# EAGLE schematic RAUPS (EAGLE 7.2.0)
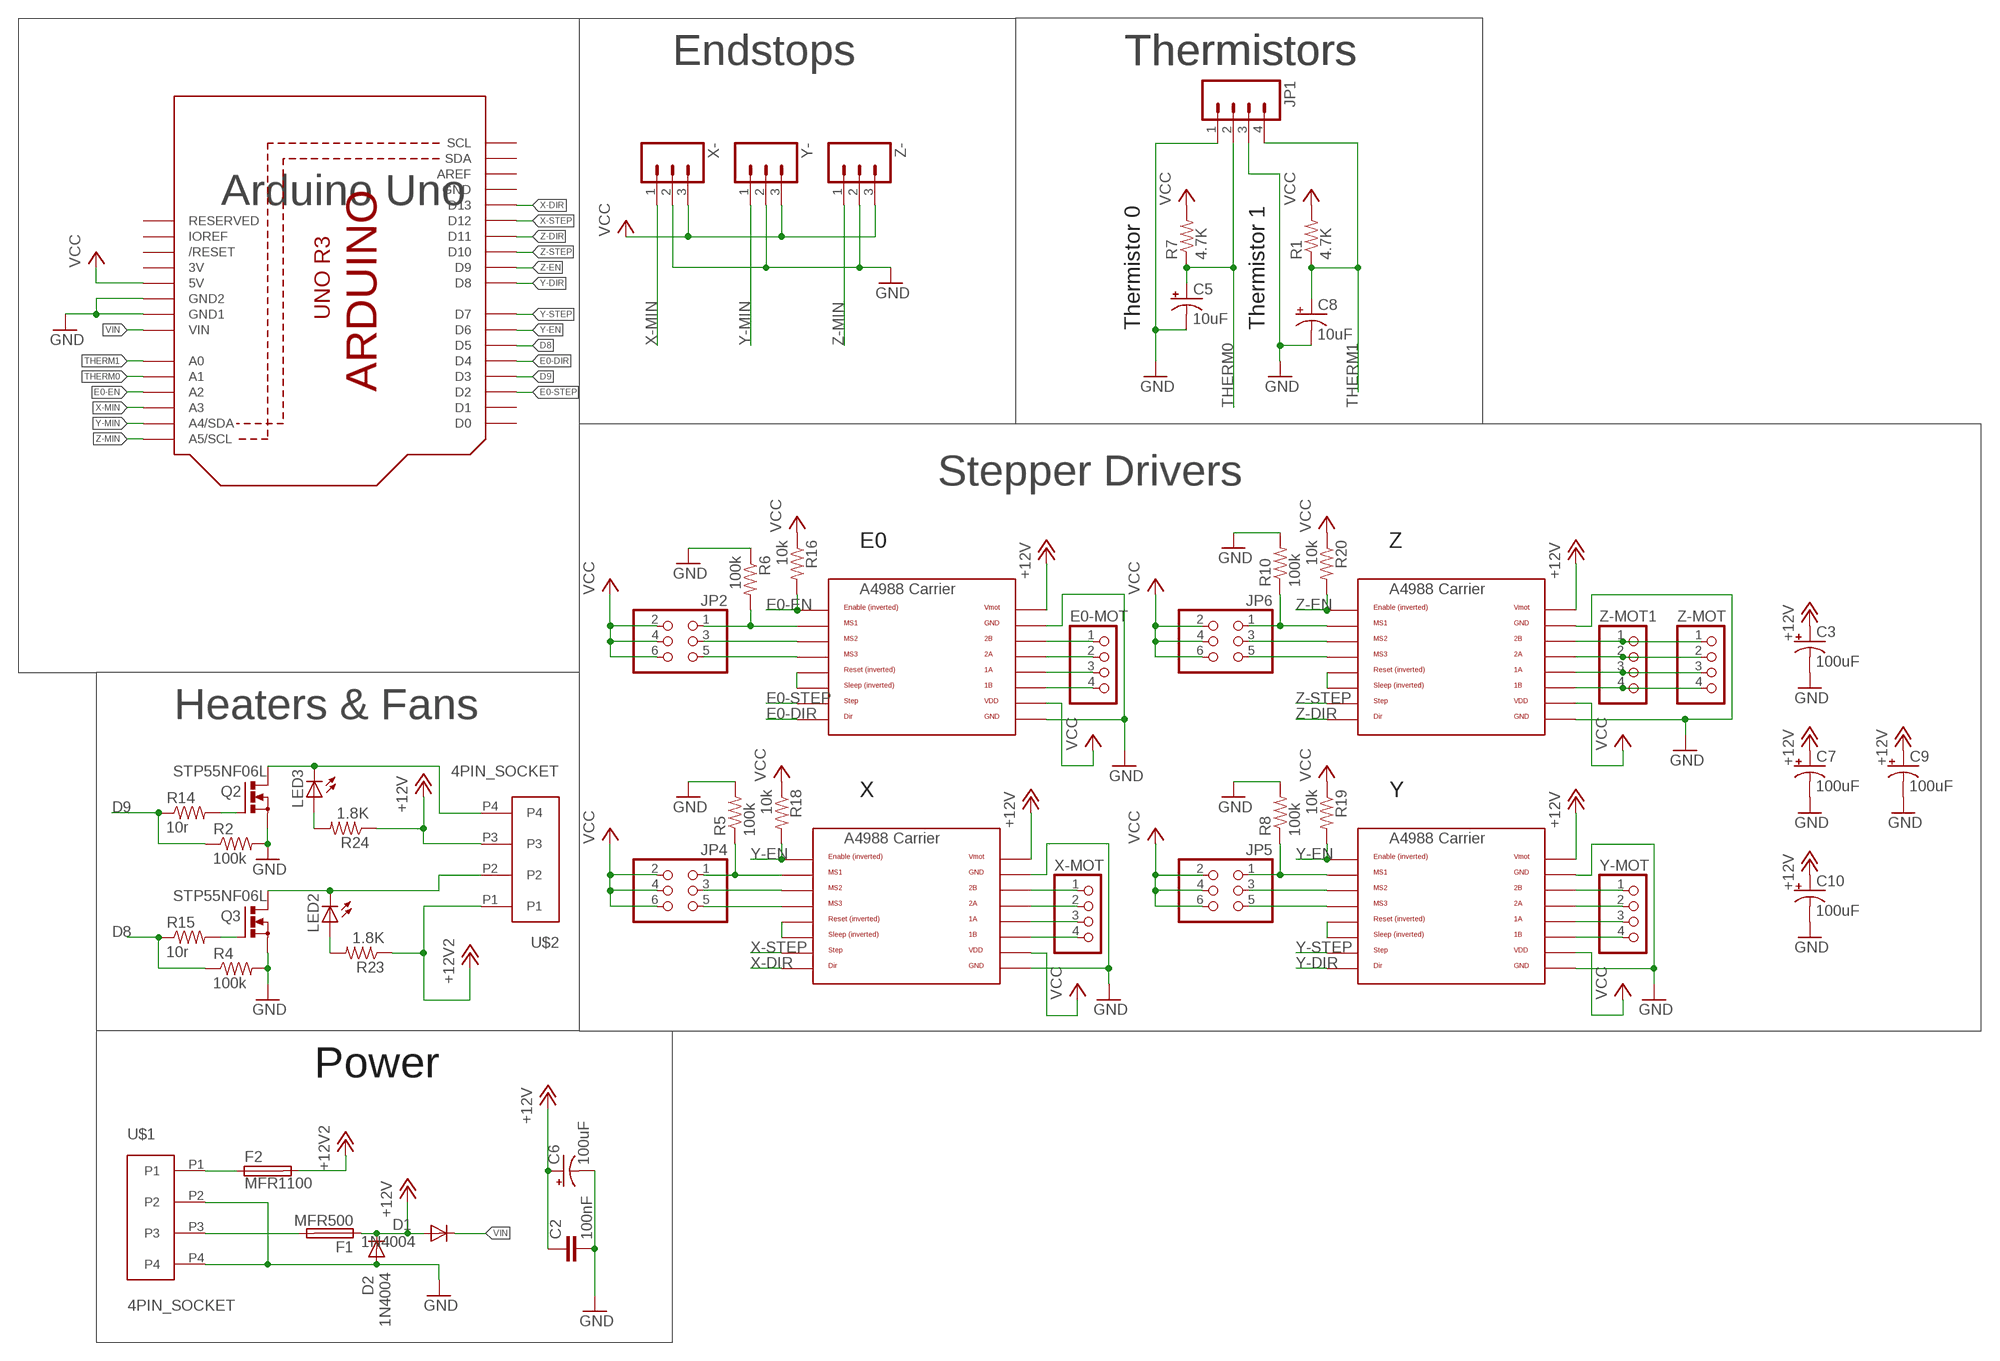
[diagram p0: schematic, sheet 1]

## Parts
C2  100nF  C-EUC0805  [C0805]
C3  100uF  CPOL-US153CLV-0605  [153CLV-0605]
C5  10uF  CPOL-US153CLV-0405  [153CLV-0405]
C6  100uF  CPOL-US153CLV-0605  [153CLV-0605]
C7  100uF  CPOL-US153CLV-0605  [153CLV-0605]
C8  10uF  CPOL-US153CLV-0405  [153CLV-0405]
C9  100uF  CPOL-US153CLV-0605  [153CLV-0605]
C10  100uF  CPOL-US153CLV-0605  [153CLV-0605]
D1  1N4004  [DO41-10]
D2  1N4004  [DO41-10]
E0-DRIVE  POLOLU_A4983CARRIER  [A4988BREAKOUT]
E0-MOT  PINHD-1X4  [1X04]
F1  MFR500  PTCFUSE  [MFR500]
F2  MFR1100  PTCFUSEMFR1100  [MFR1100]
JP1  M04PTH  [1X04]
JP2  PINHD-2X3  [2X03]
JP4  PINHD-2X3  [2X03]
JP5  PINHD-2X3  [2X03]
JP6  PINHD-2X3  [2X03]
LED2  LEDCHIP-LED0805  [CHIP-LED0805]
LED3  LEDCHIP-LED0805  [CHIP-LED0805]
Q2  STP55NF06L  IRF512  [TO220BV]
Q3  STP55NF06L  IRF512  [TO220BV]
R1  4.7K  R-US_R0805  [R0805]
R2  100k  R-US_R0805  [R0805]
R4  100k  R-US_R0805  [R0805]
R5  100k  R-US_R0805  [R0805]
R6  100k  R-US_R0805  [R0805]
R7  4.7K  R-US_R0805  [R0805]
R8  100k  R-US_R0805  [R0805]
R10  100k  R-US_R0805  [R0805]
R14  10r  R-US_M0805  [M0805]
R15  10r  R-US_R0805  [R0805]
R16  10k  R-US_R0805  [R0805]
R18  10k  R-US_R0805  [R0805]
R19  10k  R-US_R0805  [R0805]
R20  10k  R-US_R0805  [R0805]
R23  1.8K  R-US_R0805  [R0805]
R24  1.8K  R-US_R0805  [R0805]
U1  ARDUINOR3-BPLACE  [ARDUINOR3-BPLACE]
U$1  4PIN_SOCKET  [CONN-4PIN]
U$2  4PIN_SOCKET  [CONN-4PIN]
X-  M03PTH  [1X03]
X-DRIVE  A4988BREAKOUT  [A4988BREAKOUT]
X-MOT  PINHD-1X4  [1X04]
Y-  M03PTH  [1X03]
Y-DRIVE  POLOLU_A4983CARRIER  [A4988BREAKOUT]
Y-MOT  PINHD-1X4  [1X04]
Z-  M03PTH  [1X03]
Z-DRIVE  POLOLU_A4983CARRIER  [A4988BREAKOUT]
Z-MOT  PINHD-1X4  [1X04]
Z-MOT1  PINHD-1X4  [1X04]

## Nets
+12V: C2.1 C3.+ C6.+ C7.+ C9.+ C10.+ D1.A D2.C E0-DRIVE.VMOT F1.1 R24.1 U$2.P3 X-DRIVE.VMOT Y-DRIVE.VMOT Z-DRIVE.VMOT
+12V2: F2.2 R23.1 U$2.P1
D8: R4.1 R15.1 U1.D5
D9: R2.1 R14.1 U1.D3
E0-DIR: E0-DRIVE.DIR U1.D4
E0-EN: E0-DRIVE.EN R16.2 U1.A2
E0-STEP: E0-DRIVE.STEP U1.D2
GND: C2.2 C3.- C5.- C6.- C7.- C8.- C9.- C10.- D2.A E0-DRIVE.GND E0-DRIVE.GND@0(GND) JP1.1 JP1.3 Q2.S Q3.S R2.2 R4.2 R5.2 R6.1 R8.2 R10.2 U1.GND1 U1.GND2 U$1.P2 U$1.P4 X-.2 X-DRIVE.GND X-DRIVE.GND@0(GND) Y-.2 Y-DRIVE.GND Y-DRIVE.GND@0(GND) Z-.2 Z-DRIVE.GND Z-DRIVE.GND@0(GND)
N$1: LED3.C Q2.D U$2.P4
N$3: E0-DRIVE.2B E0-MOT.1
N$4: E0-DRIVE.2A E0-MOT.2
N$5: E0-DRIVE.MS1 JP2.1 R6.2
N$6: E0-DRIVE.MS3 JP2.5
N$8: E0-DRIVE.RST E0-DRIVE.SLP(SLEEP)
N$9: E0-DRIVE.MS2 JP2.3
N$10: E0-DRIVE.1A E0-MOT.3
N$11: E0-DRIVE.1B E0-MOT.4
N$14: JP4.1 R5.1 X-DRIVE.MS1
N$15: JP4.3 X-DRIVE.MS2
N$17: JP5.3 Y-DRIVE.MS2
N$19: JP4.5 X-DRIVE.MS3
N$20: X-DRIVE.RST X-DRIVE.SLP(SLEEP)
N$21: X-DRIVE.2B X-MOT.1
N$22: X-DRIVE.2A X-MOT.2
N$23: Y-DRIVE.RST Y-DRIVE.SLP(SLEEP)
N$26: X-DRIVE.1A X-MOT.3
N$27: X-DRIVE.1B X-MOT.4
N$28: Y-DRIVE.2B Y-MOT.1
N$29: Y-DRIVE.2A Y-MOT.2
N$30: Y-DRIVE.1A Y-MOT.3
N$31: JP5.5 Y-DRIVE.MS3
N$32: LED2.A R23.2
N$33: JP5.1 R8.1 Y-DRIVE.MS1
N$36: Y-DRIVE.1B Y-MOT.4
N$37: JP6.3 Z-DRIVE.MS2
N$38: Z-DRIVE.RST Z-DRIVE.SLP(SLEEP)
N$39: JP6.5 Z-DRIVE.MS3
N$40: JP6.1 R10.1 Z-DRIVE.MS1
N$41: Z-DRIVE.2B Z-MOT1.1 Z-MOT.1
N$42: Z-DRIVE.2A Z-MOT1.2 Z-MOT.2
N$43: Z-DRIVE.1A Z-MOT1.3 Z-MOT.3
N$44: Z-DRIVE.1B Z-MOT1.4 Z-MOT.4
N$45: LED3.A R24.2
N$47: Q2.G R14.2
N$49: Q3.G R15.2
N$51: LED2.C Q3.D U$2.P2
N$53: F2.1 U$1.P1
N$54: F1.2 U$1.P3
THERM0: C5.+ JP1.2 R7.1 U1.A1
THERM1: C8.+ JP1.4 R1.1 U1.A0
VCC: E0-DRIVE.VDD JP2.2 JP2.4 JP2.6 JP4.2 JP4.4 JP4.6 JP5.2 JP5.4 JP5.6 JP6.2 JP6.4 JP6.6 R1.2 R7.2 R16.1 R18.1 R19.1 R20.1 U1.5V X-.3 X-DRIVE.VDD Y-.3 Y-DRIVE.VDD Z-.3 Z-DRIVE.VDD
VIN: D1.C U1.VIN
X-DIR: U1.D13 X-DRIVE.DIR
X-MIN: U1.A3 X-.1
X-STEP: U1.D12 X-DRIVE.STEP
Y-DIR: U1.D8 Y-DRIVE.DIR
Y-EN: R18.2 R19.2 U1.D6 X-DRIVE.EN Y-DRIVE.EN
Y-MIN: U1.A4(A4/SDA) Y-.1
Y-STEP: U1.D7 Y-DRIVE.STEP
Z-DIR: U1.D11 Z-DRIVE.DIR
Z-EN: R20.2 U1.D9 Z-DRIVE.EN
Z-MIN: U1.A5(A5/SCL) Z-.1
Z-STEP: U1.D10 Z-DRIVE.STEP
Unconnected: U1.AREF U1.D0 U1.D1 U1.IOREF U1.RESERVED U1.RESET(/RESET) U1.SCL U1.SDA

## Notes on the sheet
- Endstops | Thermistors | Thermistors
- Arduino Uno
- Thermistor 0 | Thermistor 1
- Stepper Drivers
- E0 | Z
- Heaters & Fans
- X | Y
- Power

## Power pins joined to a net without a drawn wire
3V: U1.3V
GND: U1.GND

## Library data of the parts
C2 = resistor:C-EU: CAPACITOR, European symbol
C3 C5-C10 = adafruit:CPOL-US: POLARIZED CAPACITOR, American symbol
D1 D2 = diode:1N4004: DIODE general purpose rectifier, 1 A
E0-DRIVE Y-DRIVE Z-DRIVE = RepRapjr:POLOLU_A4983CARRIER
E0-MOT X-MOT Y-MOT Z-MOT Z-MOT1 = RepRapjr:PINHD-1X4: PIN HEADER
F1 F2 = RepRapjr:PTCFUSE: LITTLEFUSE Picofuse/slow Littlefuse
JP1 = SparkFun-Connectors:M04: Header 4 Standard 4-pin 0.1" header. Use with straight break away headers (SKU : PRT-00116), right angle break away headers (PRT-00553), swiss pins (PRT-00743), machine pins (PRT-00117), and female headers (PRT-00115). Molex polarized connector foot print use with SKU : PRT-08231 with associated crimp pins and housings. 1MM SMD Version SKU: PRT-10208
JP2 JP4-JP6 = pinhead:PINHD-2X3: PIN HEADER
LED2 LED3 = led:LED: LED OSRAM: - CHIPLED LG R971, LG N971, LY N971, LG Q971, LY Q971, LO R971, LY R971 LH N974, LH R974 LS Q976, LO Q976, LY Q976 LO Q996 - Hyper CHIPLED LW Q18S LB Q993, LB Q99A, LB R99A - SideLED LS A670, LO A670, LY A670, LG A670, LP A670 LB A673, LV A673, LT A673, LW A673 LH A674 LY A675 LS A676, LA A676, LO A676, LY A676, LW A676 LS A679, LY A679, LG A679 - Hyper Micro SIDELED® LS Y876, LA Y876, LO Y876, LY Y876 LT Y87S - SmartLED LW L88C, LW L88S LB L89C, LB L89S, LG L890 LS L89K, LO L89K, LY L89K LS L896, LA L896, LO L896, LY L896 - TOPLED LS T670, LO T670, LY T670, LG T670, LP T670 LSG T670, LSP T670, LSY T670, LOP T670, LYG T670 LG T671, LOG T671, LSG T671 LB T673, LV T673, LT T673, LW T673 LH T674 LS T676, LA T676, LO T676, LY T676, LB T676, LH T676, LSB T676, LW T676 LB T67C, LV T67C, LT T67C, LS T67K, LO T67K, LY T67K, LW E67C LS E67B, LA E67B, LO E67B, LY E67B, LB E67C, LV E67C, LT E67C LW T67C LS T679, LY T679, LG T679 LS T770, LO T770, LY T770, LG T770, LP T770 LB T773, LV T773, LT T773, LW T773 LH T774 LS E675, LA E675, LY E675, LS T675 LS T776, LA T776, LO T776, LY T776, LB T776 LHGB T686 LT T68C, LB T68C - Hyper Mini TOPLED® LB M676 - Mini TOPLED Santana® LG M470 LS M47K, LO M47K, LY M47K Source: http://www.osram.convergy.de LUXEON: - LUMILED® LXK2-PW12-R00, LXK2-PW12-S00, LXK2-PW14-U00, LXK2-PW14-V00 LXK2-PM12-R00, LXK2-PM12-S00, LXK2-PM14-U00 LXK2-PE12-Q00, LXK2-PE12-R00, LXK2-PE12-S00, LXK2-PE14-T00, LXK2-PE14-U00 LXK2-PB12-K00, LXK2-PB12-L00, LXK2-PB12-M00, LXK2-PB14-N00, LXK2-PB14-P00, LXK2-PB14-Q00 LXK2-PR12-L00, LXK2-PR12-M00, LXK2-PR14-Q00, LXK2-PR14-R00 LXK2-PD12-Q00, LXK2-PD12-R00, LXK2-PD12-S00 LXK2-PH12-R00, LXK2-PH12-S00 LXK2-PL12-P00, LXK2-PL12-Q00, LXK2-PL12-R00 Source: www.luxeon.com KINGBRIGHT: KA-3528ASYC Source: www.kingbright.com
Q2 Q3 = transistor-power:IRF512: N-CHANNEL MOS FET
R1 R2 R4-R8 R10 R16 R18-R20 R23 R24 = adafruit:R-US_: RESISTOR, American symbol
R14 R15 = resistor:R-US_: RESISTOR, American symbol
U1 = adafruit:ARDUINOR3: This is a new object for the new Arduino R3 - with extra pins that you may want to use (such as IOref, and duplicated A4/A5
U$1 U$2 = ControllerCard:4PIN_SOCKET
X- Y- Z- = SparkFun-Connectors:M03: Header 3 Standard 3-pin 0.1" header. Use with straight break away headers (SKU : PRT-00116), right angle break away headers (PRT-00553), swiss pins (PRT-00743), machine pins (PRT-00117), and female headers (PRT-00115). Molex polarized connector foot print use with SKU : PRT-08232 with associated crimp pins and housings.
X-DRIVE = RepRapjr:A4988BREAKOUT